# EAGLE design CAN_Bridge (EAGLE 6.4)
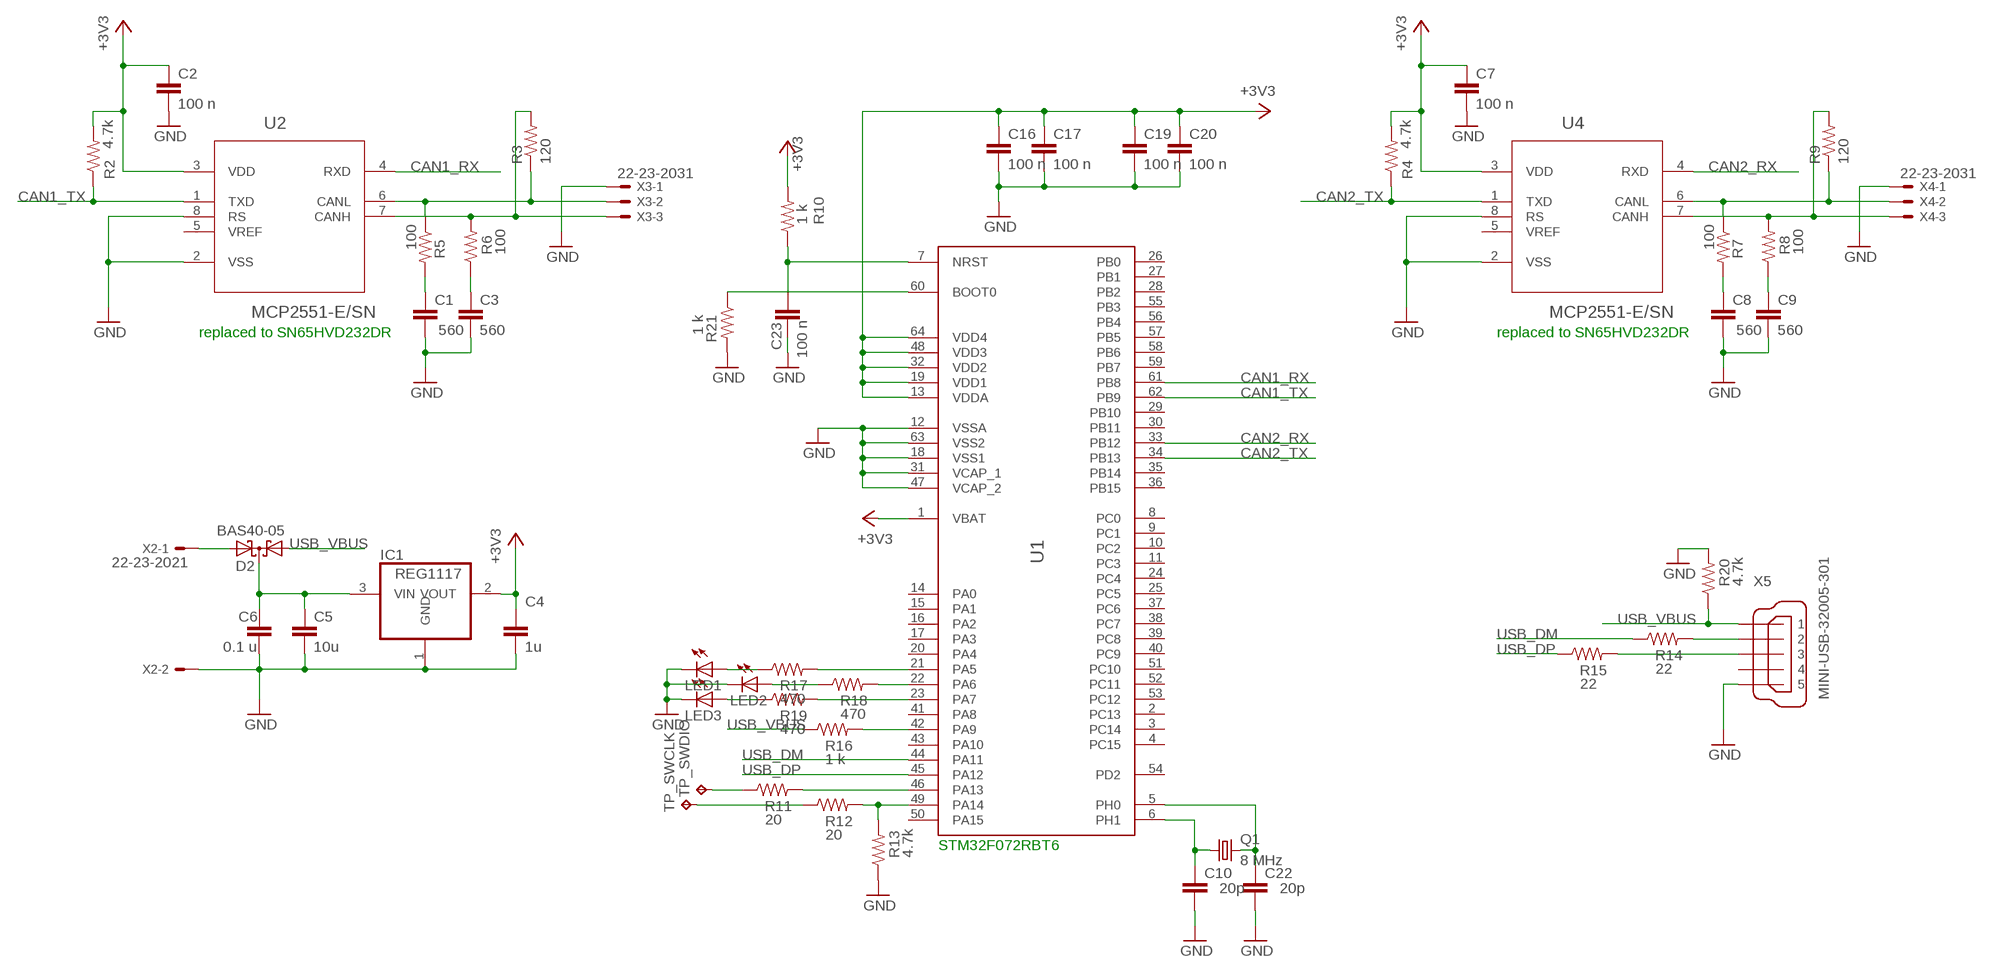
[diagram p0: schematic, sheet 1]

## Parts
C1  560  C-EUC0603  [C0603]
C2  100 n  C-EUC0603  [C0603]
C3  560  C-EUC0603  [C0603]
C4  1u  C-EUC0603  [C0603]
C5  10u  C-EUC1206  [C1206]
C6  0.1 u  C-EUC0603  [C0603]
C7  100 n  C-EUC0603  [C0603]
C8  560  C-EUC0603  [C0603]
C9  560  C-EUC0603  [C0603]
C10  20p  C-EUC0603  [C0603]
C16  100 n  C-EUC0603  [C0603]
C17  100 n  C-EUC0603  [C0603]
C19  100 n  C-EUC0603  [C0603]
C20  100 n  C-EUC0603  [C0603]
C22  20p  C-EUC0603  [C0603]
C23  100 n  C-EUC0603  [C0603]
D2  BAS40-05  [SOT23]
IC1  REG1117  [SOT223]
LED1  LED_ESML0603  [LED_SML0603]
LED2  LED_ESML0603  [LED_SML0603]
LED3  LED_ESML0603  [LED_SML0603]
Q1  8 MHz  CRYSTALSM49  [SM49]
R2  4.7k  R-US_R0603  [R0603]
R3  120  R-US_R0805  [R0805]
R4  4.7k  R-US_R0603  [R0603]
R5  100  R-US_R0603  [R0603]
R6  100  R-US_R0603  [R0603]
R7  100  R-US_R0603  [R0603]
R8  100  R-US_R0603  [R0603]
R9  120  R-US_R0805  [R0805]
R10  1 k  R-US_R0603  [R0603]
R11  20  R-US_R0603  [R0603]
R12  20  R-US_R0603  [R0603]
R13  4.7k  R-US_R0603  [R0603]
R14  22  R-US_R0603  [R0603]
R15  22  R-US_R0603  [R0603]
R16  1 k  R-US_R0603  [R0603]
R17  470  R-US_R0603  [R0603]
R18  470  R-US_R0603  [R0603]
R19  470  R-US_R0603  [R0603]
R20  4.7k  R-US_R0603  [R0603]
R21  1 k  R-US_R0603  [R0603]
TP_SWCLK  TPTP10SQ  [TP10SQ]
TP_SWDIO  TPTP10SQ  [TP10SQ]
U1  STM32F405XXSTM32F405XX  [LQFP64]
U2  MCP2551-E/SN  [SOIC127P600X175-8N]
U4  MCP2551-E/SN  [SOIC127P600X175-8N]
X2  22-23-2021  [22-23-2021]
X3  22-23-2031  [22-23-2031]
X4  22-23-2031  [22-23-2031]
X5  MINI-USB-32005-301  [32005-301]

## Nets
+3V3: C2.1 C4.1 C7.1 C16.1 C17.1 C19.1 C20.1 IC1.2(VOUT) R2.2 R4.2 R10.2 U1.1(VBAT) U1.13(VDDA) U1.19(VDD1) U1.32(VDD2) U1.48(VDD3) U1.64(VDD4) U2.3(VDD) U4.3(VDD)
CAN1_RX: U1.61(PB8) U2.4(RXD)
CAN1_TX: R2.1 U1.62(PB9) U2.1(TXD)
CAN2_RX: U1.33(PB12) U4.4(RXD)
CAN2_TX: R4.1 U1.34(PB13) U4.1(TXD)
GND: C1.2 C2.2 C3.2 C4.2 C5.2 C6.2 C7.2 C8.2 C9.2 C10.2 C16.2 C17.2 C19.2 C20.2 C22.2 C23.2 IC1.1(GND) LED1.C LED2.C LED3.C R13.1 R20.2 R21.2 U1.12(VSSA) U1.18(VSS1) U1.31(VCAP_1) U1.47(VCAP_2) U1.63(VSS2) U2.2(VSS) U2.8(RS) U4.2(VSS) U4.8(RS) X2.2 X3.1 X4.1 X5.5
N$1: R3.1 R5.1 U2.6(CANL) X3.2
N$2: R3.2 R6.2 U2.7(CANH) X3.3
N$4: C1.1 R5.2
N$6: C3.1 R6.1
N$7: R17.2 U1.21(PA5)
N$8: R7.1 R9.1 U4.6(CANL) X4.2
N$9: C5.1 C6.1 D2.3(C) IC1.3(VIN)
N$10: R8.2 R9.2 U4.7(CANH) X4.3
N$12: C8.1 R7.2
N$13: C9.1 R8.1
N$14: R18.2 U1.22(PA6)
N$15: R19.2 U1.23(PA7)
N$16: LED1.A R17.1
N$17: LED2.A R18.1
N$18: LED3.A R19.1
N$21: R11.2 U1.46(PA13)
N$22: R12.2 R13.2 U1.49(PA14)
N$24: R11.1 TP_SWDIO.TP
N$25: R12.1 TP_SWCLK.TP
N$27: C23.1 R10.1 U1.7(NRST)
N$28: R21.1 U1.60(BOOT0)
N$29: D2.2(A2) X2.1
N$30: R16.2 U1.42(PA9)
N$33: R15.2 X5.3
N$34: C22.1 Q1.2 U1.5(PH0)
N$35: C10.1 Q1.1 U1.6(PH1)
N$36: R14.2 X5.2
USB_DM: R14.1 U1.44(PA11)
USB_DP: R15.1 U1.45(PA12)
USB_VBUS: D2.1(A1) R16.1 R20.1 X5.1
Unconnected: U1.2(PC13) U1.3(PC14) U1.4(PC15) U1.8(PC0) U1.9(PC1) U1.10(PC2) U1.11(PC3) U1.14(PA0) U1.15(PA1) U1.16(PA2) U1.17(PA3) U1.20(PA4) U1.24(PC4) U1.25(PC5) U1.26(PB0) U1.27(PB1) U1.28(PB2) U1.29(PB10) U1.30(PB11) U1.35(PB14) U1.36(PB15) U1.37(PC6) U1.38(PC7) U1.39(PC8) U1.40(PC9) U1.41(PA8) U1.43(PA10) U1.50(PA15) U1.51(PC10) U1.52(PC11) U1.53(PC12) U1.54(PD2) U1.55(PB3) U1.56(PB4) U1.57(PB5) U1.58(PB6) U1.59(PB7) U2.5(VREF) U4.5(VREF) X5.4

## Notes on the sheet
- replaced to SN65HVD232DR | replaced to SN65HVD232DR
- STM32F072RBT6

## Library data of the parts
C1-C10 C16 C17 C19 C20 C22 C23 = rcl:C-EU: CAPACITOR, European symbol
D2 = diode:BAS40-05: Silicon Schottky Diodes General-purpose diode for high-speed switching
IC1 = burr-brown:REG1117: 800mA and 1A Low Dropout (LDO) Positive Regulator 1.8V, 2.5V, 2.85V, 3.3V, 5V, and Adj; MPN: REG1117; OC_FARNELL: 1097566; OC_NEWARK: 14P6981
LED1-LED3 = eagle-ltspice:LED_E: LED Source: http://www.osram.convergy.de Source: www.luxeon.com Source: www.kingbright.com; SPICEMODEL: NONE; SPICEPREFIX: D; SPICETYPE: diode
Q1 = adafruit:CRYSTAL: CRYSTAL; OC_FARNELL: unknown; OC_NEWARK: unknown
R2 R4-R8 R10-R21 = resistor:R-US_: RESISTOR, American symbol
R3 R9 = rcl:R-US_: RESISTOR, American symbol
TP_SWCLK TP_SWDIO = testpad:TP: Test pad
U1 = stm32f:STM32F405XX: Features • Core: ARM 32-bit Cortex™-M4 CPU with FPU, Adaptive real-time accelerator (ART Accelerator™) allowing 0-wait state execution from Flash memory, frequency up to 168 MHz, memory protection unit, 210 DMIPS/ 1.25 DMIPS/MHz (Dhrystone 2.1), and DSP instructions • Memories – Up to 1 Mbyte of Flash memory – Up to 192+4 Kbytes of SRAM including 64- Kbyte of CCM (core coupled memory) data RAM – Flexible static memory controller supporting Compact Flash, SRAM, PSRAM, NOR and NAND memories • LCD parallel interface, 8080/6800 modes • Clock, reset and supply management – 1.8 V to 3.6 V application supply and I/Os – POR, PDR, PVD and BOR – 4-to-26 MHz crystal oscillator – Internal 16 MHz factory-trimmed RC (1% accuracy) – 32 kHz oscillator for RTC with calibration – Internal 32 kHz RC with calibration • Low power – Sleep, Stop and Standby modes – VBAT supply for RTC, 20×32 bit backup registers + optional 4 KB backup SRAM • 3×12-bit, 2.4 MSPS A/D converters: up to 24 channels and 7.2 MSPS in triple interleaved mode • 2×12-bit D/A converters • General-purpose DMA: 16-stream DMA controller with FIFOs and burst support • Up to 17 timers: up to twelve 16-bit and two 32- bit timers up to 168 MHz, each with up to 4 IC/OC/PWM or pulse counter and quadrature (incremental) encoder input • Debug mode – Serial wire debug (SWD) & JTAG interfaces – Cortex-M4 Embedded Trace Macrocell™ • Up to 140 I/O ports with interrupt capability – Up to 136 fast I/Os up to 84 MHz – Up to 138 5 V-tolerant I/Os • Up to 15 communication interfaces – Up to 3 × I2C interfaces (SMBus/PMBus) – Up to 4 USARTs/2 UARTs (10.5 Mbit/s, ISO 7816 interface, LIN, IrDA, modem control) – Up to 3 SPIs (42 Mbits/s), 2 with muxed full-duplex I2S to achieve audio class accuracy via internal audio PLL or external clock – 2 × CAN interfaces (2.0B Active) – SDIO interface • Advanced connectivity – USB 2.0 full-speed device/host/OTG controller with on-chip PHY – USB 2.0 high-speed/full-speed device/host/OTG controller with dedicated DMA, on-chip full-speed PHY and ULPI – 10/100 Ethernet MAC with dedicated DMA: supports IEEE 1588v2 hardware, MII/RMII • 8- to 14-bit parallel camera interface up to 54 Mbytes/s • True random number generator • CRC calculation unit • 96-bit unique ID • RTC: subsecond accuracy, hardware calendar
U2 U4 = MCP2551-E_SN:MCP2551-E/SN: High-Speed CAN Transceiver; DESCRIPTION: High-Speed CAN Transceiver; MPN: MCP2551-E/SN; OC_FARNELL: 1467746; OC_NEWARK: 92C4186; PACKAGE: SOIC-8; SUPPLIER: Microchip
X2 = con-molex:22-23-2021: .100" (2.54mm) Center Header - 2 Pin; MF: MOLEX; MPN: 22-23-2021; OC_FARNELL: 1462926; OC_NEWARK: 25C3832
X3 X4 = con-molex:22-23-2031: .100" (2.54mm) Center Header - 3 Pin; MF: MOLEX; MPN: 22-23-2031; OC_FARNELL: 1462950; OC_NEWARK: 30C0862
X5 = con-cypressindustries:MINI-USB-: MINI USB-B Conector Source: www.cypressindustries.com; OC_FARNELL: unknown; OC_NEWARK: unknown

## Board
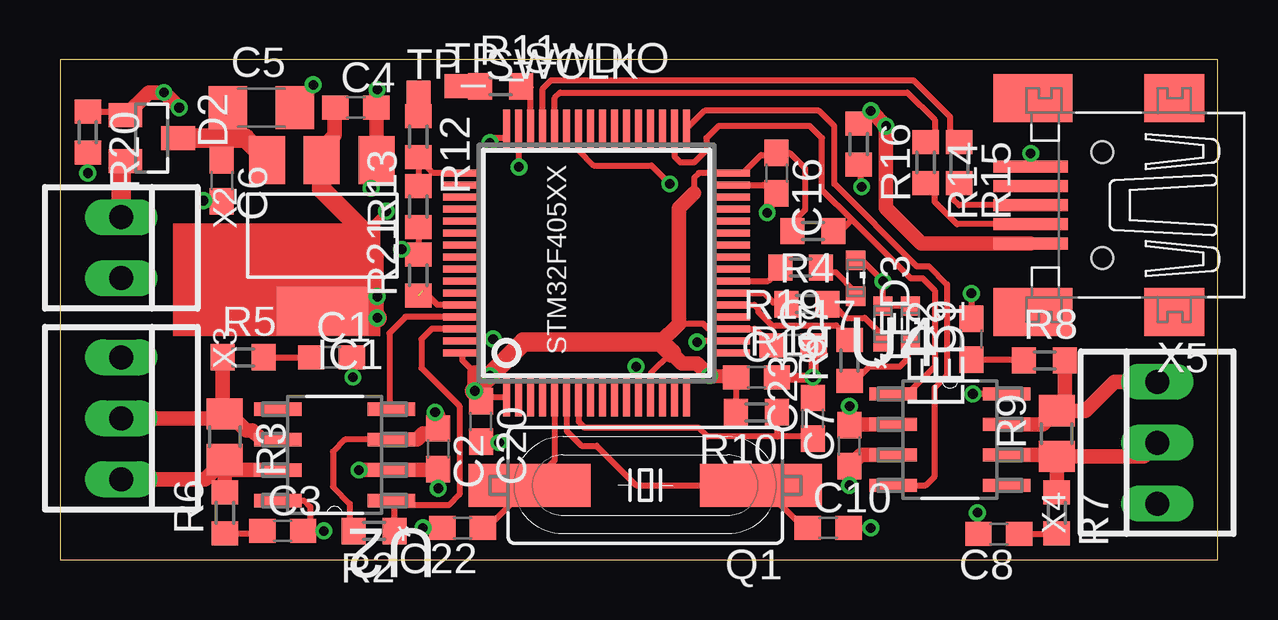
[diagram p1: board, top side]
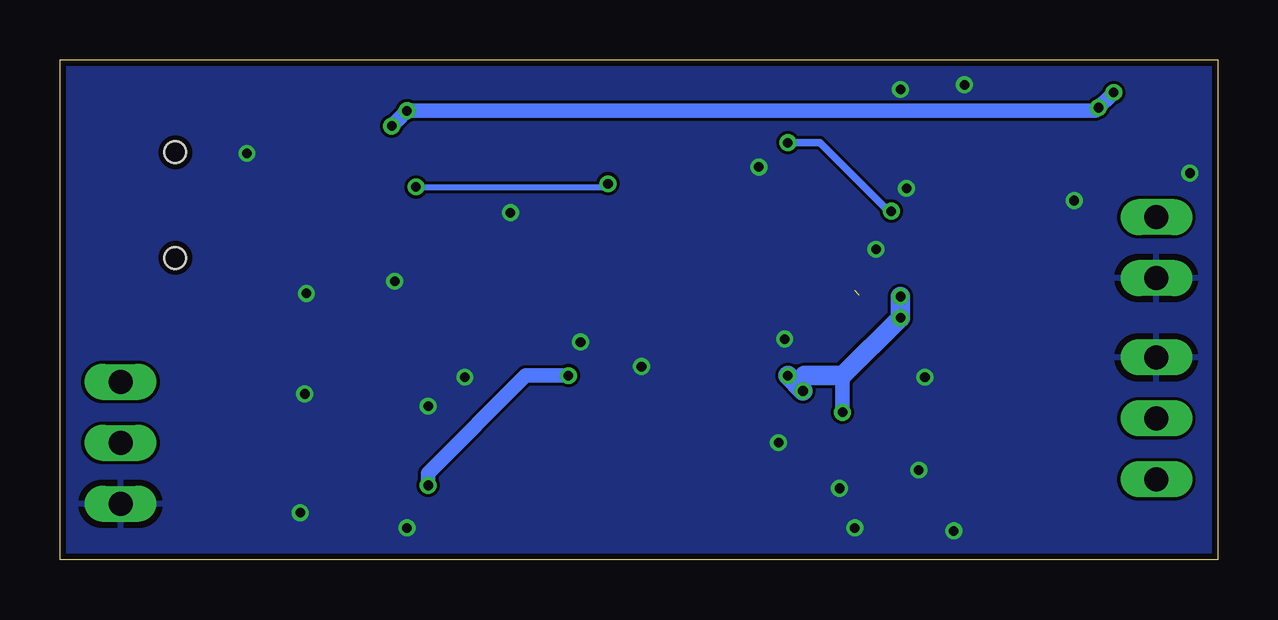
[diagram p2: board, bottom side, seen from below]

Size 48.26 x 20.85 mm. Coordinates in mm from the lower left corner, seen from the top.
Outline: 0,0 48.26,0 48.26,20.85 0,20.85 0,0
Copper layers (1*16): Top 0.035mm / dielectric 1.5mm / Bottom 0.035mm
Design rules "dirt_cheap_dirty_boards.v1": minimum track width 5mil, minimum drill 12mil, track to track 5mil, track to pad 5mil, pad to pad 5mil, via to via 5mil, smd to smd 0mil, copper to edge 10mil, drill to drill 10mil, minimum pad ring 10mil, minimum via ring 6mil, stop-mask expansion 2mil, vias tented up to drill 25mil, thermal gap 10mil

### Footprints (pad centres in the part's own frame; a part is rotated, then mirrored left to right if it is on the bottom)
C0603 = smd 1.1 x 1: 1 -0.85,0; 2 0.85,0
C1206 = smd 1.6 x 1.8: 1 -1.4,0; 2 1.4,0
SOT23 = smd 1 x 1.4: 1 -0.95,-1.1; 2 0.95,-1.1; 3 0,1.1
SOT223 = smd 1.499 x 2.007: 1 -2.261,-3.15; 2 0.025,-3.15; 3 2.311,-3.15 | smd 3.81 x 2.007: 4 0,3.15
LED_SML0603 = smd 0.8 x 0.8: A 0.75,0; C -0.75,0
SM49 = smd 5.08 x 1.778: 1 -4.826,0; 2 4.826,0
R0603 = smd 1 x 1.1: 1 -0.85,0; 2 0.85,0
R0805 = smd 1.3 x 1.5: 1 -0.95,0; 2 0.95,0
TP10SQ = smd 1 x 1: TP 0,0
LQFP64 = smd 1.6 x 0.3: 1 -5.6,3.75; 2 -5.6,3.25; 3 -5.6,2.75; 4 -5.6,2.25; 5 -5.6,1.75; 6 -5.6,1.25; 7 -5.6,0.75; 8 -5.6,0.25; 9 -5.6,-0.25; 10 -5.6,-0.75; 11 -5.6,-1.25; 12 -5.6,-1.75; 13 -5.6,-2.25; 14 -5.6,-2.75; 15 -5.6,-3.25; 16 -5.6,-3.75; 33 5.6,-3.75; 34 5.6,-3.25; 35 5.6,-2.75; 36 5.6,-2.25; 37 5.6,-1.75; 38 5.6,-1.25; 39 5.6,-0.75; 40 5.6,-0.25; 41 5.6,0.25; 42 5.6,0.75; 43 5.6,1.25; 44 5.6,1.75; 45 5.6,2.25; 46 5.6,2.75; 47 5.6,3.25; 48 5.6,3.75 | smd 0.3 x 1.6: 17 -3.75,-5.6; 18 -3.25,-5.6; 19 -2.75,-5.6; 20 -2.25,-5.6; 21 -1.75,-5.6; 22 -1.25,-5.6; 23 -0.75,-5.6; 24 -0.25,-5.6; 25 0.25,-5.6; 26 0.75,-5.6; 27 1.25,-5.6; 28 1.75,-5.6; 29 2.25,-5.6; 30 2.75,-5.6; 31 3.25,-5.6; 32 3.75,-5.6; 49 3.75,5.6; 50 3.25,5.6; 51 2.75,5.6; 52 2.25,5.6; 53 1.75,5.6; 54 1.25,5.6; 55 0.75,5.6; 56 0.25,5.6; 57 -0.25,5.6; 58 -0.75,5.6; 59 -1.25,5.6; 60 -1.75,5.6; 61 -2.25,5.6; 62 -2.75,5.6; 63 -3.25,5.6; 64 -3.75,5.6
SOIC127P600X175-8N = smd 1.981 x 0.559: 1 -2.362,1.905; 2 -2.362,0.635; 3 -2.362,-0.635; 4 -2.362,-1.905; 5 2.362,-1.905; 6 2.362,-0.635; 7 2.362,0.635; 8 2.362,1.905
22-23-2021 = drill 1 long: 1 -1.27,0; 2 1.27,0
22-23-2031 = drill 1 long: 1 -2.54,0; 2 0,0; 3 2.54,0
32005-301 = smd 3.1 x 0.5: 1 3,1.6; 2 3,0.8; 3 3,0; 4 3,-0.8; 5 3,-1.6 | smd 2.5 x 2: M1 -3,-4.45; M2 -3,4.45 | smd 3.3 x 2: M3 2.9,4.45; M4 2.9,-4.45 | hole 0.9: 0,2.2; 0,-2.2

### Placement (x,y rotation side)
C1  11.32,8.45 0 top
C2  15.76,4.64 270 top
C3  9.29,1.21 0 top
C4  12.33,18.86 0 top
C5  8.4,18.86 0 top
C6  6.75,15.81 270 top
C7  32.91,4.76 90 top
C8  39.13,1.08 180 top
C9  37.99,9.21 90 top
C10  32.02,1.33 0 top
C16  29.86,16.13 270 top
C17  30.56,8.95 0 top
C19  29.04,7.62 0 top
C20  17.54,5.78 270 top
C22  16.78,1.33 180 top
C23  31.39,5.91 90 top
D2  3.83,17.59 270 top
IC1  10.94,13.53 180 top
LED1  35.45,9.84 270 top
LED2  34.31,9.84 270 top
LED3  33.16,11.75 270 top
Q1  24.4,3.11 180 top
R2  13.1,1.21 180 top
R3  6.87,5.14 270 top
R4  31.39,13.72 180 top
R5  7.64,8.45 0 top
R6  6.87,1.97 90 top
R7  41.55,1.97 270 top
R8  41.04,8.32 0 top
R9  41.55,5.27 90 top
R10  29.04,6.16 180 top
R11  18.37,19.75 0 top
R12  14.94,17.65 270 top
R13  14.94,14.73 90 top
R14  36.08,16.57 270 top
R15  37.48,16.57 270 top
R16  33.29,17.34 270 top
R17  32.91,8.32 90 top
R18  31.13,10.67 180 top
R19  30.88,12.19 180 top
R20  1.16,17.84 270 top
R21  14.94,11.87 90 top
TP_SWCLK  14.94,19.49 0 top
TP_SWDIO  16.53,19.75 0 top
U1  22.37,12.38 90 top
U2  11.45,4.38 180 top
U4  37.1,5.02 0 top
X2  2.56,13.02 270 top
X3  2.56,5.91 270 top
X4  45.74,4.89 90 top
X5  43.45,14.8 180 top

### Tracks (layer width: path | path; a pad name or v marks a point on that pad's centre or on a via)
+3V3  (via drill 0.4)
  Top 0.254: C19.1 28.17,7.56 R10.2 | U1.13 24.62,7.77 25.48,8.64 | U1.1 17.44,6.78 C20.1 | U1.48 18.62,17.65 18.56,17.59 18.05,17.59 v17.92,17.4 | C17.1 28.97,9.63 U1.19 27.02,9.63 26.81,9.84 25.8,9.84 25.8,9.97 | 26.43,15.3 26.43,15.94 26.63,16.13 U1.32 28,16.16 28.5,16.16 29.23,16.89 29.77,16.89 C16.1 | U2.3 11.89,5.02 11.38,4.51 11.38,3.05 12.08,2.35 12.08,1.37 R2.2 | 30.01,16.64 C16.1 | R4.2 30.54,14.07 31.07,14.6 31.07,16.32 30.43,16.95 29.89,16.95 C16.1 | U1.64 16.77,8.33 17.29,7.81
  Top 0.305: v13.6,14.54 12.72,13.65
  Top 0.406: 12.72,13.65 12.72,13.02 13.1,12.64
  Top 0.61: U2.3 14.88,5.02 15.13,5.27 15.55,5.27 C2.1 15.76,6.03 v15.64,6.16 | C19.1 v27.07,7.68 26.56,8.19 25.92,8.19 25.48,8.64 | IC1.2 10.91,17.18 11.45,17.72 11.45,18.82 C4.1 | 13.1,10.22 13.1,10.48 | 17.29,7.81 v17.29,7.05 17.67,6.76 C20.1 | 25.8,9.84 25.04,9.08 | 26.43,15.3 25.8,14.67 25.8,9.97 | U4.3 33.38,4.38 C7.1 v32.91,3.11
  Top 0.813: IC1.2 10.91,15.46 12.72,13.65 | 13.1,12.64 13.1,10.48 | 13.1,10.22 v13.22,10.1 | 25.48,8.64 25.04,9.08 19.32,9.08 v17.29,7.05
  Bottom 0.254: 17.23,7.68 16.91,7.68 16.75,7.85
  Bottom 0.305: v17.92,17.4 16.59,17.4 13.73,14.54 v13.6,14.54
  Bottom 0.61: 15.64,7.68 v15.64,6.16 | v27.07,7.68 28.85,7.68 32.91,3.62 v32.91,3.11
  Bottom 0.813: v13.22,10.99 v13.22,10.1 15.64,7.68 17.23,7.68 17.35,7.56 17.35,7.11 v17.29,7.05 v17.92,7.68
CAN1_RX
  Top 0.254: U1.61 14.4,10.13 13.73,9.46 13.73,6.36 U2.4
CAN1_TX
  Top 0.254: 13.93,2.35 U2.1 | U2.1 14,2.29 16.21,2.29 16.65,2.73 16.65,6.41 15.07,8 15.07,9.21 15.49,9.63 U1.62 | R2.1 13.95,2.34 U2.1
CAN2_RX
  Top 0.254: U4.4 36.08,3.11 36.47,3.49 36.47,7.18 36.97,7.68 36.97,11.49 36.21,12.26 35.7,12.26 32.27,15.68 32.27,18.1 31.64,18.73 26.87,18.73 U1.33
CAN2_TX
  Top 0.254: 35.32,6.79 35.32,6.92 | 35.32,6.92 U4.1 | U1.34 25.62,16.82 25.86,16.57 26.43,16.57 26.94,17.08 26.94,17.59 27.45,18.1 31.26,18.1 31.77,17.59 31.77,15.43 33,14.19 | 33,14.19 35.45,11.75 35.96,11.75 36.47,11.24 36.47,8.06 35.32,6.92 | R4.1 32.4,13.59 33,14.19
GND  (via drill 0.4)
  Top 0.254: C8.2 v38.24,1.97 | 33.25,5.65 C7.2 | C2.2 15.76,3.75 | v11,1.21 C3.2 10.43,1.5 10.43,2.22 10.18,2.48 U2.8 | C1.2 12.17,7.64 v12.21,7.62 | C23.2 v31.39,7.62 31.41,7.9 | U1.18 26.61,9.13 v26.56,9.08 | U1.12 24.12,8.09 v24.02,8.06 | U1.63 18,9.13 v18.05,9.21 | C22.2 v15.13,1.33 | C20.2 18.52,4.93 v18.3,4.89 | C10.2 v33.8,1.33 | 40.45,17.03 v40.47,16.95 | v37.99,11.11 C9.2 | LED3.C 33.43,12.5 v34.31,11.62 LED2.C LED1.C | R20.2 v1.16,16.13 | C6.2 v5.99,14.99 | C5.2 9.8,19.05 v10.56,19.81 | v14.24,12.95 14.47,12.72 R21.2 R13.1 | U4.8 v38.05,6.92 | U1.47 v19.12,16.39 v19.13,16.38 | U1.31 29.32,15.63 C16.2 29.89,15.02 v29.48,14.48
  Top 0.406: C19.2 v31.39,7.62 | X5.5 40.45,17.03 | C17.2 31.41,7.9
  Top 0.61: C7.2 v32.91,6.41 | U4.2 33.25,5.65 | v15.76,2.98 15.76,3.75 U2.2 v12.46,3.75 | IC1.1 13.2,18.85 C4.2 13.18,19.52 v13.22,19.62
  other vias: 12.97,15.49
  pour Bottom: 0.14,0.19 0.14,20.64 48.02,20.64 48.02,0.19
N$1
  Top 0.61: X3.2 6.69,5.91 R3.1 | R3.1 7.19,6.09 | R5.1 6.79,6.18 R3.1 | U2.6 8.4,5.02 8.02,5.4 7.76,5.4 7.38,5.78 7.19,5.78 R3.1
N$2
  Top 0.61: 6.94,4.13 R3.2 | R6.2 6.87,3.62 | 6.87,3.62 R3.2 | X3.3 6.05,3.37 R3.2 | U2.7 7,3.75 6.87,3.62
N$4
  Top 0.254: R5.2 C1.1
N$6
  Top 0.254: R6.1 8.35,1.12 C3.1
N$7
  Top 0.254: U1.21 28.94,10.63 29.1,10.48 29.1,10.35 29.67,9.78 32.36,9.78 R17.2
N$8
  Top 0.61: U4.6 41.48,4.38 R9.1 | R9.1 45.17,4.32 X4.2 | R7.1 R9.1
N$9
  Top 0.813: D2.3 6.75,17.59 | 6.75,17.59 7.13,17.59 | 7.13,17.59 7.71,17.59 IC1.3 | C5.1 7,17.72 7.13,17.59 | C6.1 6.75,17.59
N$10
  Top 0.61: U4.7 40.98,5.65 R9.2 | R9.2 42.75,6.22 43.96,7.43 X4.3 | R8.2 41.89,6.56 R9.2
N$12
  Top 0.254: C8.1 41.51,1.08 R7.2
N$13
  Top 0.254: C9.1 40.15,8.36 R8.1
N$14
  Top 0.254: U1.22 29.33,11.13 29.73,10.73 29.77,10.73 R18.2
N$15
  Top 0.254: U1.23 29.53,11.63 R19.2
N$16
  Top 0.254: R17.1 33.14,7.47 33.73,8.06 35,8.06 35.32,8.38 LED1.A
N$17
  Top 0.254: R18.1 32.27,10.6 32.78,10.1 33.54,10.1 34.31,9.33 LED2.A
N$18
  Top 0.254: R19.1 32.15,12 32.34,12 33.16,11.18 LED3.A
N$21
  Top 0.254: U1.46 19.62,19.7 R11.2
N$22
  Top 0.254: U1.49 15.53,16.13 R12.2 R13.2
N$24
  Top 0.254: TP_SWDIO.TP 17.67,19.46 R11.1
N$25
  Top 0.254: R12.1 TP_SWCLK.TP
N$27
  Top 0.254: C23.1 31.17,5.14 29.93,5.14 | U1.7 21.62,5.77 21.86,5.52 26.62,5.52 27,5.14 29.93,5.14 | R10.1 29.89,5.18 29.93,5.14
N$28  (1 unrouted)
  Top 0.254: U1.60 15.74,10.63 15.13,11.24
N$29
  Top 0.813: X2.1 2.56,16.47 D2.2
N$30  (via drill 0.4)
  Top 0.254: U1.42 21.61,17.97 21.61,17.08 22.24,16.45 24.65,16.45 v25.42,15.68 | R16.2 v33.42,15.56
  Bottom 0.254: v25.42,15.68 25.54,15.56 v33.42,15.56
N$33
  Top 0.254: X5.3 37.48,14.8 37.23,15.05 37.23,15.47 R15.2
N$34
  Top 0.254: U1.5 20.62,4.16 Q1.2 17.92,1.46 C22.1
N$35
  Top 0.254: U1.6 21.12,5.38 21.73,4.76 22.37,4.76 24.02,3.11 Q1.1 | Q1.1 29.23,3.15 | C10.1 31,1.33 Q1.1
N$36
  Top 0.254: X5.2 37.39,14 36.47,14.92 36.47,15.34 R14.2
USB_DM
  Top 0.254: U1.44 20.62,19.27 20.84,19.49 35.32,19.49 36.47,18.35 36.47,17.8 R14.1
USB_DP
  Top 0.254: U1.45 20.12,19.66 20.46,20 35.58,20 37.1,18.48 37.1,17.8 R15.1
USB_VBUS  (via drill 0.4)
  Top 0.254: 34.34,18.19 v34.43,18.1 | R20.1 2.57,18.69 D2.1 | R16.1 33.29,18.35 v33.8,18.73
  Top 0.61: X5.1 35.91,13.2 34.43,14.67 v34.43,18.1 v33.8,18.73 | D2.1 2.74,18.54 3.7,19.49 v4.33,19.49 v4.97,18.86
  Bottom 0.61: v4.33,19.49 5.1,18.73 v33.8,18.73 v34.43,18.1
(copper drawn outside any net)
  shapes: Top area x1